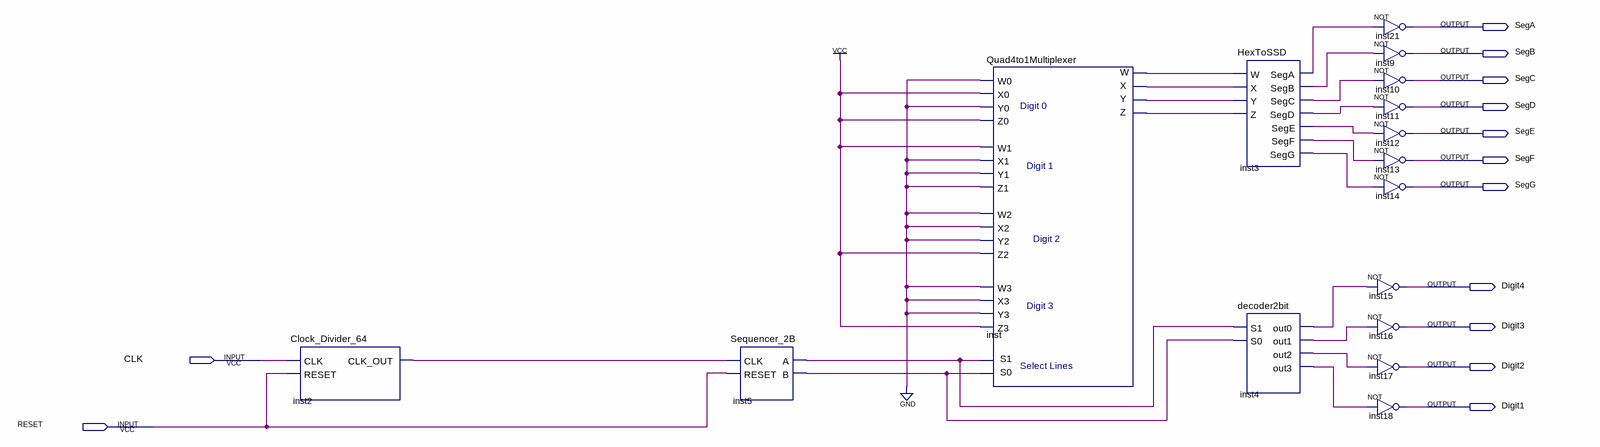
[diagram p0: schematic sheet]
// Quartus schematic TopLevel.bdf as structural Verilog: 16 symbols, 13 pins
module TopLevel (
  input  CLK,
  input  RESET,
  output SegA,
  output SegB,
  output SegC,
  output SegD,
  output SegE,
  output SegF,
  output SegG,
  output Digit4,
  output Digit3,
  output Digit2,
  output Digit1
);

  wire inst2_clk_out, inst3_sega, inst3_segb, inst3_segc, inst3_segd, inst3_sege, inst3_segf, inst3_segg,
       inst4_out0, inst4_out1, inst4_out2, inst4_out3, inst5_a, inst5_b, inst_w, inst_x, inst_y, inst_z;

  Clock_Divider_64 inst2 (.CLK(CLK), .RESET(RESET), .CLK_OUT(inst2_clk_out));
  Sequencer_2B inst5 (.CLK(inst2_clk_out), .RESET(RESET), .A(inst5_a), .B(inst5_b));
  Quad4to1Multiplexer inst (
    .W0(1'b0), .W1(1'b1), .W2(1'b0), .W3(1'b0), .X0(1'b1), .X1(1'b0), .X2(1'b0), .X3(1'b0), .Y0(1'b0),
    .Y1(1'b0), .Y2(1'b0), .Y3(1'b0), .Z0(1'b1), .Z1(1'b0), .Z2(1'b1), .Z3(1'b1), .S1(inst5_a), .S0(inst5_b),
    .W(inst_w), .X(inst_x), .Y(inst_y), .Z(inst_z));
  HexToSSD inst3 (
    .W(inst_w), .X(inst_x), .Y(inst_y), .Z(inst_z), .SegA(inst3_sega), .SegB(inst3_segb), .SegC(inst3_segc),
    .SegD(inst3_segd), .SegE(inst3_sege), .SegF(inst3_segf), .SegG(inst3_segg));
  decoder2bit inst4 (
    .S1(inst5_a), .S0(inst5_b), .out0(inst4_out0), .out1(inst4_out1), .out2(inst4_out2), .out3(inst4_out3));
  not inst21 (SegA, inst3_sega);
  not inst9 (SegB, inst3_segb);
  not inst10 (SegC, inst3_segc);
  not inst11 (SegD, inst3_segd);
  not inst12 (SegE, inst3_sege);
  not inst13 (SegF, inst3_segf);
  not inst14 (SegG, inst3_segg);
  not inst15 (Digit4, inst4_out0);
  not inst16 (Digit3, inst4_out1);
  not inst17 (Digit2, inst4_out2);
  not inst18 (Digit1, inst4_out3);
endmodule
